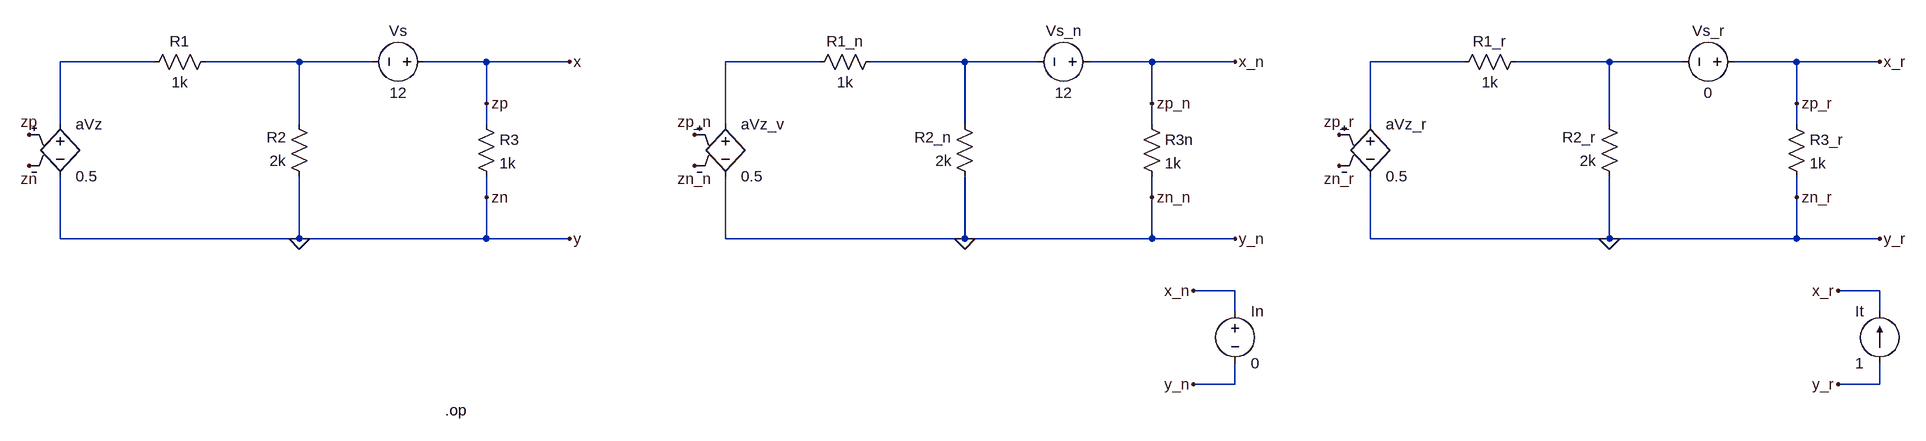
[diagram p0: schematic HW04P02.asc]
HW04P02.asc, the LTspice schematic file:
Version 4
SHEET 1 3284 680
WIRE 560 32 416 32
WIRE 784 32 640 32
WIRE 896 32 784 32
WIRE 1072 32 976 32
WIRE 1200 32 1072 32
WIRE 1584 32 1440 32
WIRE 1808 32 1664 32
WIRE 1920 32 1808 32
WIRE 2096 32 2000 32
WIRE 2224 32 2096 32
WIRE 2576 32 2432 32
WIRE 2800 32 2656 32
WIRE 2912 32 2800 32
WIRE 3088 32 2992 32
WIRE 3216 32 3088 32
WIRE 1072 96 1072 32
WIRE 2096 96 2096 32
WIRE 3088 96 3088 32
WIRE 416 128 416 32
WIRE 784 128 784 32
WIRE 1072 128 1072 96
WIRE 1440 128 1440 32
WIRE 1808 128 1808 32
WIRE 2096 128 2096 96
WIRE 2432 128 2432 32
WIRE 2800 128 2800 32
WIRE 3088 128 3088 96
WIRE 1072 240 1072 208
WIRE 2096 240 2096 208
WIRE 3088 240 3088 208
WIRE 416 304 416 208
WIRE 784 304 784 208
WIRE 784 304 416 304
WIRE 1072 304 1072 240
WIRE 1072 304 784 304
WIRE 1200 304 1072 304
WIRE 1440 304 1440 208
WIRE 1808 304 1808 208
WIRE 1808 304 1440 304
WIRE 2096 304 2096 240
WIRE 2096 304 1808 304
WIRE 2224 304 2096 304
WIRE 2432 304 2432 208
WIRE 2800 304 2800 208
WIRE 2800 304 2432 304
WIRE 3088 304 3088 240
WIRE 3088 304 2800 304
WIRE 3216 304 3088 304
WIRE 2224 384 2160 384
WIRE 3216 384 3152 384
WIRE 2224 416 2224 384
WIRE 3216 416 3216 384
WIRE 2224 528 2224 496
WIRE 2224 528 2160 528
WIRE 3216 528 3216 496
WIRE 3216 528 3152 528
FLAG 1072 96 zp
FLAG 1072 240 zn
FLAG 1200 32 x
FLAG 1200 304 y
FLAG 368 144 zp
FLAG 368 192 zn
FLAG 784 304 0
FLAG 2096 96 zp_n
FLAG 2096 240 zn_n
FLAG 2224 32 x_n
FLAG 2224 304 y_n
FLAG 1392 144 zp_n
FLAG 1392 192 zn_n
FLAG 1808 304 0
FLAG 2160 384 x_n
FLAG 2160 528 y_n
FLAG 3088 96 zp_r
FLAG 3088 240 zn_r
FLAG 3216 32 x_r
FLAG 3216 304 y_r
FLAG 2384 144 zp_r
FLAG 2384 192 zn_r
FLAG 2800 304 0
FLAG 3152 384 x_r
FLAG 3152 528 y_r
DATAFLAG 1168 32 ""
DATAFLAG 3184 32 ""
SYMBOL e 416 112 R0
SYMATTR InstName aVz
SYMATTR Value 0.5
SYMBOL res 656 16 R90
WINDOW 0 0 56 VBottom 2
WINDOW 3 32 56 VTop 2
SYMATTR InstName R1
SYMATTR Value 1k
SYMBOL res 800 224 R180
WINDOW 0 36 76 Left 2
WINDOW 3 36 40 Left 2
SYMATTR InstName R2
SYMATTR Value 2k
SYMBOL voltage 992 32 R90
WINDOW 0 -32 56 VBottom 2
WINDOW 3 32 56 VTop 2
SYMATTR InstName Vs
SYMATTR Value 12
SYMBOL res 1056 112 R0
SYMATTR InstName R3
SYMATTR Value 1k
SYMBOL e 1440 112 R0
SYMATTR InstName aVz_v
SYMATTR Value 0.5
SYMBOL res 1680 16 R90
WINDOW 0 0 56 VBottom 2
WINDOW 3 32 56 VTop 2
SYMATTR InstName R1_n
SYMATTR Value 1k
SYMBOL res 1824 224 R180
WINDOW 0 36 76 Left 2
WINDOW 3 36 40 Left 2
SYMATTR InstName R2_n
SYMATTR Value 2k
SYMBOL voltage 2016 32 R90
WINDOW 0 -32 56 VBottom 2
WINDOW 3 32 56 VTop 2
SYMATTR InstName Vs_n
SYMATTR Value 12
SYMBOL res 2080 112 R0
SYMATTR InstName R3n
SYMATTR Value 1k
SYMBOL voltage 2224 400 R0
SYMATTR InstName In
SYMATTR Value 0
SYMBOL e 2432 112 R0
SYMATTR InstName aVz_r
SYMATTR Value 0.5
SYMBOL res 2672 16 R90
WINDOW 0 0 56 VBottom 2
WINDOW 3 32 56 VTop 2
SYMATTR InstName R1_r
SYMATTR Value 1k
SYMBOL res 2816 224 R180
WINDOW 0 36 76 Left 2
WINDOW 3 36 40 Left 2
SYMATTR InstName R2_r
SYMATTR Value 2k
SYMBOL voltage 3008 32 R90
WINDOW 0 -32 56 VBottom 2
WINDOW 3 32 56 VTop 2
SYMATTR InstName Vs_r
SYMATTR Value 0
SYMBOL res 3072 112 R0
SYMATTR InstName R3_r
SYMATTR Value 1k
SYMBOL current 3216 496 R180
WINDOW 0 24 80 Left 2
WINDOW 3 24 0 Left 2
SYMATTR InstName It
SYMATTR Value 1
TEXT 1008 568 Left 2 !.op

The netlist it stands for:
* HW04P02.asc
E§aVz N001 0 x 0 0.5
R1 N002 N001 1k
R2 0 N002 2k
Vs x N002 12
R3 x 0 1k
E§aVz_v N003 0 x_n 0 0.5
R1_n N004 N003 1k
R2_n 0 N004 2k
Vs_n x_n N004 12
R3n x_n 0 1k
V§In x_n 0 0
E§aVz_r N005 0 x_r 0 0.5
R1_r N006 N005 1k
R2_r 0 N006 2k
Vs_r x_r N006 0
R3_r x_r 0 1k
It 0 x_r 1
.op
.backanno
.end